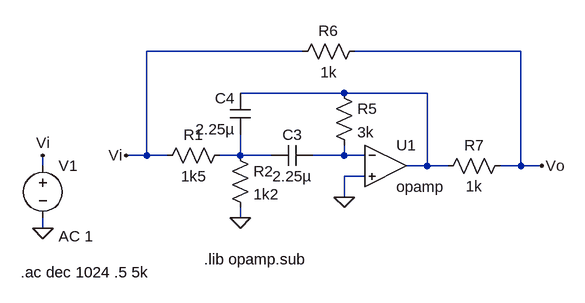
[diagram p0: schematic notch_50.asc]
notch_50.asc, the LTspice schematic file:
Version 4
SHEET 1 880 680
WIRE 48 0 -192 0
WIRE 384 0 128 0
WIRE 112 64 -48 64
WIRE 240 64 112 64
WIRE -192 160 -192 0
WIRE -192 160 -224 160
WIRE -160 160 -192 160
WIRE -48 160 -48 128
WIRE -48 160 -80 160
WIRE 0 160 -48 160
WIRE 112 160 112 144
WIRE 112 160 64 160
WIRE 144 160 112 160
WIRE -352 176 -352 160
WIRE 240 176 240 64
WIRE 240 176 208 176
WIRE 272 176 240 176
WIRE 384 176 384 0
WIRE 384 176 352 176
WIRE 416 176 384 176
WIRE 144 192 112 192
WIRE 112 224 112 192
WIRE -48 256 -48 240
WIRE -352 272 -352 256
FLAG 112 224 0
FLAG -224 160 Vi
FLAG 416 176 Vo
FLAG -48 256 0
FLAG -352 272 0
FLAG -352 160 Vi
SYMBOL OpAmps\\opamp 176 112 R0
SYMATTR InstName U1
SYMBOL res -64 144 R90
WINDOW 0 0 56 VBottom 2
WINDOW 3 32 56 VTop 2
SYMATTR InstName R1
SYMATTR Value 1k5
SYMBOL res -64 144 R0
SYMATTR InstName R2
SYMATTR Value 1k2
SYMBOL cap 64 144 R90
WINDOW 0 0 32 VBottom 2
WINDOW 3 32 32 VTop 2
SYMATTR InstName C3
SYMATTR Value 2.25µ
SYMBOL cap -32 128 R180
WINDOW 0 24 56 Left 2
WINDOW 3 24 8 Left 2
SYMATTR InstName C4
SYMATTR Value 2.25µ
SYMBOL res 96 48 R0
SYMATTR InstName R5
SYMATTR Value 3k
SYMBOL res 368 160 R90
WINDOW 0 0 56 VBottom 2
WINDOW 3 32 56 VTop 2
SYMATTR InstName R7
SYMATTR Value 1k
SYMBOL res 144 -16 R90
WINDOW 0 0 56 VBottom 2
WINDOW 3 32 56 VTop 2
SYMATTR InstName R6
SYMATTR Value 1k
SYMBOL voltage -352 160 R0
WINDOW 123 24 124 Left 2
WINDOW 39 0 0 Left 0
SYMATTR InstName V1
SYMATTR Value ""
SYMATTR Value2 AC 1
TEXT -104 320 Left 2 !.lib opamp.sub
TEXT -386 340 Left 2 !.ac dec 1024 .5 5k

The netlist it stands for:
* notch_50.asc
XU1 N003 0 N001 opamp Aol=100K GBW=10Meg  ; pins invin noninvin out
R1 N002 Vi 1k5
R2 N002 0 1k2
C3 N003 N002 2.25µ
C4 N002 N001 2.25µ
R5 N001 N003 3k
R7 Vo N001 1k
R6 Vo Vi 1k
V1 Vi 0 AC 1
.lib opamp.sub
.ac dec 1024 .5 5k
.backanno
.end